# Altium project ESD_Assignment.PrjPcb
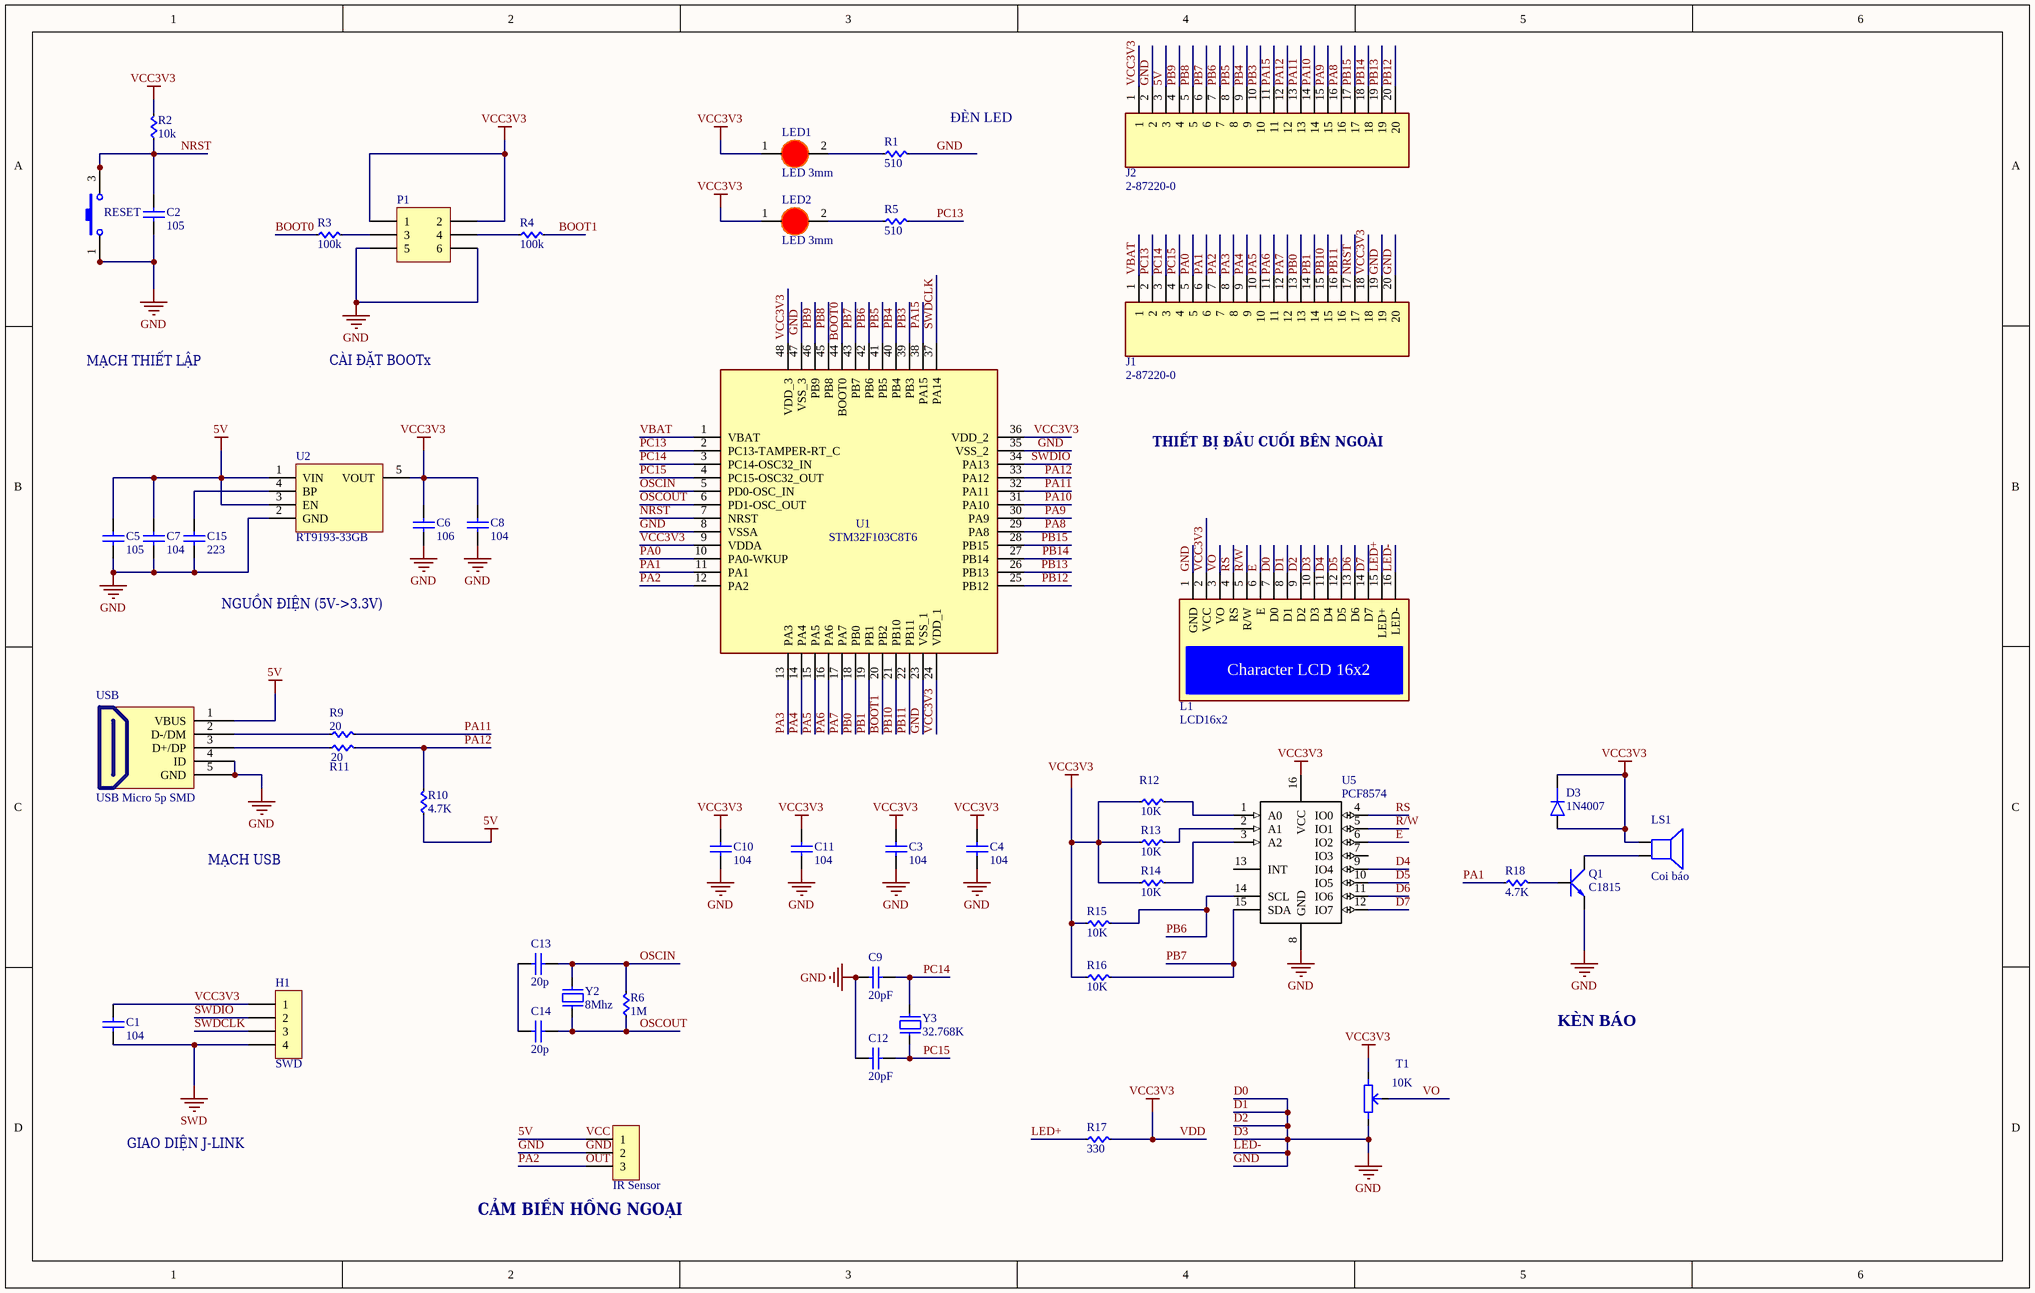
[diagram p0: schematic.SchDoc]
1 sheet, 50 parts. Net scope: global (net labels, ports and power ports of the same name join across sheets).
Board files: bangmach.PcbDoc, PCB3.PcbDoc

## Sheet schematic.SchDoc
size 381 x 241 mm; SheetNumber: 1; SheetTotal: 1

### Parts
(Parts that share a designator on the sheet are numbered #1, #2 ... from top to bottom, then left to right.)
C1  104  [tu 0603]
C2  105  [tu 0603]
C3  104  [tu 0603]
C4  104  [tu 0603]
C5  105  [tu 0603]
C6  106  [tu 0603]
C7  104  [tu 0603]
C8  104  [tu 0603]
C9  20pF  [tu 0805]
C10  104  [tu 0603]
C11  104  [tu 0603]
C12  20pF  [tu 0805]
C13  20p  [tu 0805]
C14  20p  [tu 0805]
C15  223  [tu 0603]
D3  1N4007  [DO-214AC-2 (SMA)]
H1#1  SWD  [XH2.54M-4]
H1#2  IR Sensor  [Header 3P DC 2.54]
J1  2-87220-0  [TE_2-87220-0]
J2  2-87220-0  [TE_2-87220-0]
L1  LCD16x2  [LCD16X2_3 HOLES]
LED1  LED 3mm  [LED-3MM-RED]
LED2  LED 3mm  [LED-3MM-RED]
LS1  Coi báo  [Coi Chip Speacker]
P1  95278-101A06LF  [HDR_M_2X3_2.54_SMD]  (value not drawn)
Q1  C1815  [TO92]
R1  510  [RES 0402]
R2  10k  [RES 0402]
R3  100k  [RES 0402]
R4  100k  [RES 0402]
R5  510  [RES 0402]
R6  1M  [RES 0402]
R9  20  [RES 0402]
R10  4.7K  [RES 0402]
R11  20  [RES 0402]
R12  10K  [RES 0402]
R13  10K  [RES 0402]
R14  10K  [RES 0402]
R15  10K  [RES 0402]
R16  10K  [RES 0402]
R17  330  [RES 0402]
R18  4.7K  [RES 0402]
RESET  5ESH935  [SW_5ESH935]  (value not drawn)
T1  10K  [Bien Tro Tam Giac Dung]
U1  STM32F103C8T6  [LQFP-48_19.6_393_58X11_SMD]
U2  RT9193-33GB  [SOT23-5]
U5  PCF8574  [DIP16]
USB  USB Micro 5p SMD  [USB Micro 5p SMD]
Y2  8Mhz  [Thach Anh 2 chan SMD5032]
Y3  32.768K  [Thach Anh 2 chan SMD5032]

### Nets
5V: C5.1 C7.1 H1#2.1 J2.3 R10.1 U2.1(VIN) U2.3(EN) USB.1(VBUS)  [also labelled VCC]
D0: C2.2 C3.2 C4.2 C5.2 C6.2 C7.2 C8.2 C9.2 C10.2 C11.2 C12.2 C15.2 H1#2.2 J1.19 J1.20 J2.2 L1.1(GND) L1.7(D0) L1.8(D1) L1.9(D2) L1.10(D3) L1.16(LED-) P1.5 P1.6 Q1.1(E) R1.2 RESET.1(C/M) RESET.2(C/M) T1.3 U1.8(VSSA) U1.23(VSS_1) U1.35(VSS_2) U1.47(VSS_3) U2.2(GND) U5.8(GND) USB.4(ID) USB.5(GND)  [also labelled D1, D2, D3, GND, LED-]
SWD: C1.2 H1#1.4
VCC3V3: C1.1 C3.1 C4.1 C6.1 C8.1 C10.1 C11.1 D3.A D3.K H1#1.1 J1.18 J2.1 L1.2(VCC) LED1.1(A) LED2.1(A) LS1.1 P1.1 P1.2 R2.2 R12.1 R13.1 R14.1 R15.1 R16.1 R17.2 T1.1 U1.9(VDDA) U1.24(VDD_1) U1.36(VDD_2) U1.48(VDD_3) U2.5(VOUT) U5.16(VCC)  [also labelled VDD]
BOOT0: R3.1 U1.44(BOOT0)
BOOT1: R4.2 U1.20(PB2)
D4: L1.11(D4) U5.9(IO4)
D5: L1.12(D5) U5.10(IO5)
D6: L1.13(D6) U5.11(IO6)
D7: L1.14(D7) U5.12(IO7)
E: L1.6(E) U5.6(IO2)
LED+: L1.15(LED+) R17.1
NRST: C2.1 J1.17 R2.1 RESET.3(UP) RESET.4(DOWN) U1.7(NRST)
OSCIN: C13.1 R6.2 U1.5(PD0-OSC_IN) Y2.2
OSCOUT: C14.1 R6.1 U1.6(PD1-OSC_OUT) Y2.1
OUT: H1#2.3 J1.7 U1.12(PA2)  [also labelled PA2]
PA0: J1.5 U1.10(PA0-WKUP)
PA1: J1.6 R18.1 U1.11(PA1)
PA3: J1.8 U1.13(PA3)
PA4: J1.9 U1.14(PA4)
PA5: J1.10 U1.15(PA5)
PA6: J1.11 U1.16(PA6)
PA7: J1.12 U1.17(PA7)
PA8: J2.16 U1.29(PA8)
PA9: J2.15 U1.30(PA9)
PA10: J2.14 U1.31(PA10)
PA11: J2.13 R9.2 U1.32(PA11)
PA12: J2.12 R10.2 R11.2 U1.33(PA12)
PA15: J2.11 U1.38(PA15)
PB0: J1.13 U1.18(PB0)
PB1: J1.14 U1.19(PB1)
PB3: J2.10 U1.39(PB3)
PB4: J2.9 U1.40(PB4)
PB5: J2.8 U1.41(PB5)
PB6: J2.7 R15.2 U1.42(PB6) U5.14(SCL)
PB7: J2.6 R16.2 U1.43(PB7) U5.15(SDA)
PB8: J2.5 U1.45(PB8)
PB9: J2.4 U1.46(PB9)
PB10: J1.15 U1.21(PB10)
PB11: J1.16 U1.22(PB11)
PB12: J2.20 U1.25(PB12)
PB13: J2.19 U1.26(PB13)
PB14: J2.18 U1.27(PB14)
PB15: J2.17 U1.28(PB15)
PC13: J1.2 R5.2 U1.2(PC13-TAMPER-RT_C)
PC14: C9.1 J1.3 U1.3(PC14-OSC32_IN) Y3.2
PC15: C12.1 J1.4 U1.4(PC15-OSC32_OUT) Y3.1
R/W: L1.5(R/W) U5.5(IO1)
RS: L1.4(RS) U5.4(IO0)
SWDCLK: H1#1.3 U1.37(PA14)
SWDIO: H1#1.2 U1.34(PA13)
VBAT: J1.1 U1.1(VBAT)
VO: L1.3(VO) T1.2
NetC13_2: C13.2 C14.2
NetC15_1: C15.1 U2.4(BP)
NetLED1_2: LED1.2(K) R1.1
NetLED2_2: LED2.2(K) R5.1
NetLS1_2: LS1.2 Q1.2(C)
NetP1_3: P1.3 R3.2
NetP1_4: P1.4 R4.1
NetQ1_3: Q1.3(B) R18.2
NetR9_1: R9.1 USB.2(D-/DM)
NetR11_1: R11.1 USB.3(D+/DP)
NetR12_2: R12.2 U5.1(A0)
NetR13_2: R13.2 U5.2(A1)
NetR14_2: R14.2 U5.3(A2)

Not connected (* = marked no-connect by the designer): U5 7(IO3) 13(INT)

### Notes on the sheet
- (near R1) ĐÈN LED
- MẠCH THIẾT LẬP
- CÀI ĐẶT BOOTx
- THIẾT BỊ ĐẦU CUỐI BÊN NGOÀI
- NGUỒN ĐIỆN (5V->3.3V)
- MẠCH USB
- KÈN BÁO
- GIAO DIỆN J-LINK
- (near H1#2) CẢM BIẾN HỒNG NGOẠI

### Library data of the parts
C1 C2 C5-C9 C12-C15 = Tu 0402 220nF 6.3V 20%: Dán; Don_Vi: Con; So_Chan: 2; Ten_Linh_Kien: Tụ 0402 220nF 6.3V 20%; Ma_Hang: MH008102; Chung_Loai: Dán; Kieu_Chan: *
C3 C4 C10 C11 = Tu 0603 104 50V 10%: Dán; Don_Vi: Con; So_Chan: 2; Ten_Linh_Kien: Tụ 0603 104-100nF 10% 50V; Ma_Hang: MH004568; Chung_Loai: Dán; Kieu_Chan: *
D3 = D_SMA: Diode SMD SMA (DO-214AA)
H1#1 = Header 4P 2.54 Duc Thang: Cắm; Ten_Linh_Kien: Header 4P XH2.54-4P Đực Thẳng; Don_Vi: Con; Ma_Hang: MH001285; Chung_Loai: Cắm
H1#2 = Header 3P 2.54 Duc Cong: Cắm; Ten_Linh_Kien: Header 3P XH2.54-3P Đực Cong; Don_Vi: Con; Ma_Hang: MH001302; Chung_Loai: Cắm
J1 J2 = 2-87220-0: MF: TE Connectivity; Number_of_Positions: 20; Product_Type: Connector; Centerline_Pitch: 2.54 mm[.1 in]; Price: None; MP: 2-87220-0; Package: None; Value: *; Availability: Warning; EU_RoHS_Compliance: Compliant; SnapEDA_Link: https://www.snapeda.com/parts/2-87220-0/TE%20Connectivity%20AMP%20Connectors/view-part/397035/?ref=snap; Purchase-URL: https://pricing.snapeda.com/search/part/2-87220-0/?ref=eda
L1 = LCD16x2: Character LCD 16x2
LED1 LED2 = LED 3mm Do: Cắm; Don_Vi: Con; Ma_Hang: MH003892; Ten_Linh_Kien: Led 3MM Phủ Đỏ (10c); Ghi_Chu: *; Kieu_Chan: *; Chung_Loai: Cắm
LS1 = Coi Chip Speaker: Còi chip
P1 = HDR_M_95278-101A06LF: BERGSTIK HDR 6POS .100" DR SMT; Manufacturer: Amphenol FCI; Connector Type: Header; Pitch - Mating: 0.100" (2.54mm); Number of Positions: 6; Number of Positions Loaded: All; Style: Board to Board; Shrouding: Unshrouded; Contact Length - Mating: 0.232" (5.90mm); Material Flammability Rating: UL94 V-0; Supplier 1: Digi-Key; Manufacturer Part Number: 95278-101A06LF; RoHS: RoHS Compliant; Category: Connectors, Interconnects; Stock 1: 11648; Pricing 1: 1=1.09, 10=0.96, 100=0.8284 (USD); Packaging: Digi-Reel®; Part Status: Active; Contact Type: Male Pin; Number of Rows: 2; Row Spacing - Mating: 0.100" (2.54mm); Mounting Type: Surface Mount; Termination: Solder; Fastening Type: Push-Pull; Contact Length - Post: -; Overall Contact Length: -; Insulation Height: 0.100" (2.54mm); Contact Shape: Square; Contact Finish - Mating: Gold, GXT™; Contact Finish Thickness - Mating: 30µin (0.76µm); Contact Finish - Post: Tin; Contact Material: Phosphor Bronze; Insulation Material: Thermoplastic; Features: Pick and Place; Operating Temperature: -; Ingress Protection: -; Insulation Color: Black; Current Rating: -; Voltage Rating: -; Mated Stacking Heights: -; Contact Finish Thickness - Post: 78.7µin (2.00µm); Applications: -; ComponentLink1URL: http://cdn.amphenol-icc.com/media/wysiwyg/files/drawing/95278.pdf; ComponentLink1Description: http://cdn.amphenol-icc.com/media/wysiwyg/files/drawing/95278.pdf; Supplier Part Number 1: 609-3487-6-ND
Q1 = Trans C1815 DIP: NPN transistor; Value: C9014
R1 R3-R6 R9-R11 R17 R18 = RES 0402: RES SMD 0402; Manufacturer: Vishay Dale; Manufacturer Part Number: CRCW040210K0FKED; Resistance (Ohms): 10k; Tolerance: ±1%; Power (Watts): 0.063W, 1/16W; Temperature Coefficient: ±100ppm/°C; Supplier 1: Digi-Key; RoHS: RoHS Compliant; Category: Resistors; Stock 1: 2392462; Pricing 1: 10=0.083, 50=0.0444, 200=0.0255, 1000=0.0174 (USD); Packaging: Cut Tape (CT); Composition: Thick Film; Features: Automotive AEC-Q200; Operating Temperature: -55°C ~ 155°C; Package / Case: 0402 (1005 Metric); Supplier Device Package: 0402 (1005 Metric); Size / Dimension: 0.039" L x 0.020" W (1.00mm x 0.50mm); Height: 0.016" (0.40mm); Number of Terminations: 2; ComponentLink1URL: http://www.vishay.com/docs/20035/dcrcwe3.pdf; ComponentLink1Description: http://www.vishay.com/docs/20035/dcrcwe3.pdf; Supplier Part Number 1: 541-10.0KLCT-ND
R2 R12-R16 = RES 0402: RES SMD 0402; Manufacturer: Vishay Dale; Manufacturer Part Number: CRCW040210K0FKED; Tolerance: ±1%; Power (Watts): 0.063W, 1/16W; Temperature Coefficient: ±100ppm/°C; Supplier 1: Digi-Key; RoHS: RoHS Compliant; Category: Resistors; Stock 1: 2392462; Pricing 1: 10=0.083, 50=0.0444, 200=0.0255, 1000=0.0174 (USD); Packaging: Cut Tape (CT); Resistance (Ohms): 10k; Composition: Thick Film; Features: Automotive AEC-Q200; Operating Temperature: -55°C ~ 155°C; Package / Case: 0402 (1005 Metric); Supplier Device Package: 0402 (1005 Metric); Size / Dimension: 0.039" L x 0.020" W (1.00mm x 0.50mm); Height: 0.016" (0.40mm); Number of Terminations: 2; ComponentLink1URL: http://www.vishay.com/docs/20035/dcrcwe3.pdf; ComponentLink1Description: http://www.vishay.com/docs/20035/dcrcwe3.pdf; Supplier Part Number 1: 541-10.0KLCT-ND
RESET = SW_5ESH935: SWITCH TACTILE SPST-NO 0.05A 24V; Manufacturer 1: MEC Switches; Category 1: Switches; Switch Function: Off-Mom; Contact Rating @ Voltage: 0.05A @ 24VDC; Actuator Type: Plunger for Cap; Actuator Height off PCB, Vertical: 6.40mm; Actuator Orientation: Top Actuated; Outline: 10.10mm x 10.10mm; Illumination: Non-Illuminated; Operating Force: 350gf; Ingress Protection: IP67 - Dust Tight, Waterproof; Actuator Material: Polyphenylene Sulfide (PPS); Switch Travel: 1.00mm; Mechanical Life: 10,000,000 Cycles; Supplier 1: Digi-Key; Supplier Part Number 1: 679-2579-ND; Manufacturer Part Number 1: 5ESH935; RoHS 1: RoHS Compliant; Description 1: SWITCH TACTILE SPST-NO 0.05A 24V; Stock 1: 0; Pricing 1: 1=2.68, 10=2.575, 25=2.3692, 50=2.06, 100=1.957, 250=1.90552, 500=1.854, 1000=1.442, 5000=1.339 (USD); Packaging: Tube; Part Status: Active; Circuit: SPST-NO; Mounting Type: Surface Mount; Actuator Length, Right Angle: -; Termination Style: Gull Wing; Illumination Type, Color: -; Illumination Voltage (Nominal): -; Features: Sealed - Flux Protection; Operating Temperature: -40°C ~ 160°C; ComponentLink1URL: http://www.mec.dk/files/MEC/brochures/MEC_ProductCatalogueno7_multimec-5-series-switches.pdf; ComponentLink1Description: http://www.mec.dk/files/MEC/brochures/MEC_ProductCatalogueno7_multimec-5-series-switches.pdf
T1 = Bien tro tam giac 100K Dung: Cắm; Don_Vi: Con; Ten_Linh_Kien: Biến Trở Tam Giác 104-100K RM065; Ma_Hang: MH003711; Chung_Loai: Cắm; Ghi_Chu: *; Kieu_Chan: *
U1 = IC_STM32F103C8T6: ARM® Cortex®-M3 STM32F1 Microcontroller IC 32-Bit 72MHz 64KB (64K x 8) FLASH 48-LQFP (7x7) /; Manufacturer: STMicroelectronics; Alternate Part Number-1: NA; Manufacturer Part Number: STM32F103C8T6; Case/Package: LQFP48; Supplier-1: LCSC; Supplier Part Number-1: STM32F103C8T6
U2 = REG_5.5V-3.3V-0.3A-1W-SOT-23-5: Linear Voltage Regulator IC 1 Output 300mA SOT-23-5; Manufacturer: Richtek USA Inc.; Alternate Part Number-1: NA; Manufacturer Part Number: RT9193-33GB; Supplier-1: LCSC; Supplier Part Number-1: C15651; Case/Package: SOT-23-5
U5 = PCF8574: I2C PORT EXPANDER; Manufacturer Part Number: PCF8574T/3,512; Manufacturer: NXP Semiconductors; Includes: POR; Interface: I²C; Interrupt Output: Yes; Number of I /O: 8; Voltage - Supply: 2.5 V ~ 6 V; Frequency - Clock: 100KHz; Supplier 1: Digi-Key; Supplier Part Number 1: 568-1076-5-ND; Package / Case: 16-SOIC (7.5mm Width); Category: Integrated Circuits (ICs); Supplier Part Number: 568-1076-5-ND; Operating Temperature: -40°C ~ 85°C; Packaging: Tube; RoHS: RoHS Compliant; Supplier: Digi-Key
USB = USB Micro 5p SMD: USB Type B; Ten: MicroUSB MK5P SMD; Ma_Hang: MH001020
Y2 Y3 = Thach Anh 2 chan SMD 5032: Crystal For all Crystal 2pin.; Value: 4Mhz